# Altium schematic sheet Robot-Control V4.0.SchDoc: ROV-Control
size A4; Date: 2019.6.25; ApprovedBy: 10; CompanyName: 9; Engineer: 淹死的鱼; Organization: 5; Address1: ROV/AUV; Address2: V1.0; Address3: 淹死的鱼; Address4: 12; DocumentNumber: P1; Revision: 3; SheetNumber: 2; SheetTotal: 1; Time: 2019.4.6; DocumentFullPathAndName: 8; DocumentName: 7; ModifiedDate: 6; ImagePath: C:\Users\zengwangfa\Pictures\Saved Pictures\电协logo重绘（10000像素版）.png; ProjectName: 4; Application_BuildNumber: 11
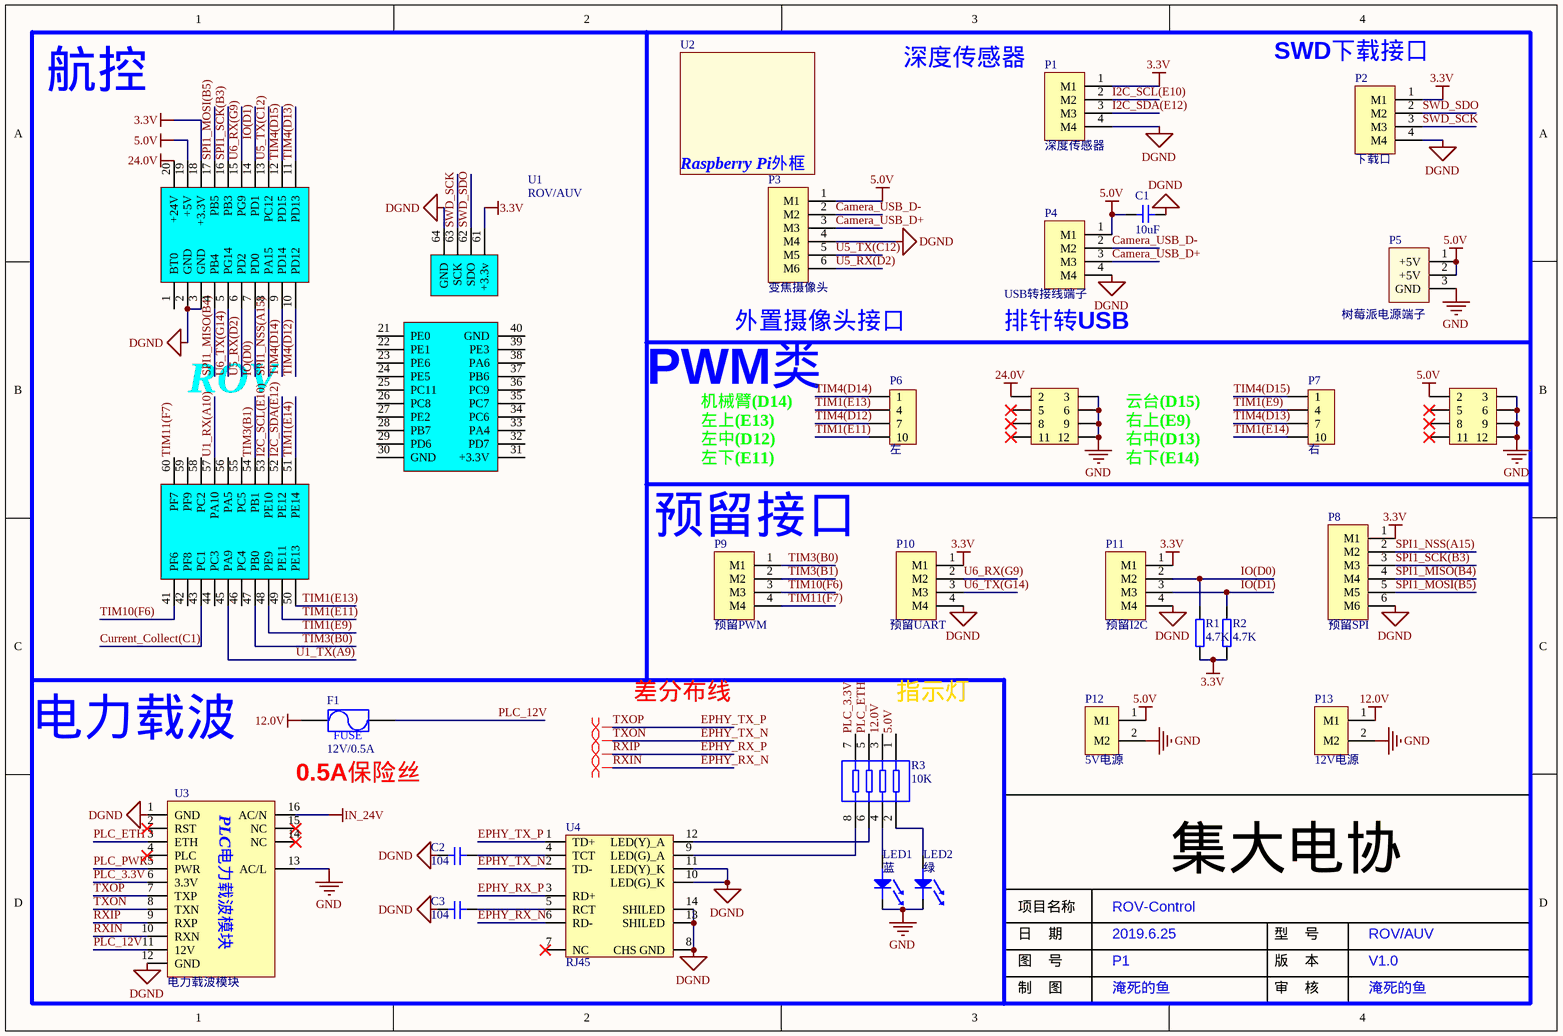
[diagram p0: Robot-Control V4.0.SchDoc]

## Parts
?  (no value)  [JMU_LOGO(1.35cm)]
C1  10uF  [0805C]
C2  104  [0805C]
C3  104  [0805C]
F1  12V/0.5A  [FUSE-1206]
LED1  蓝  [0805LED(RED)]
LED2  绿  [0805LED(RED)]
P1  深度传感器  [MX1.25WS-4P]
P2  下载口  [MX1.25WS-4P]
P3  变焦摄像头  [MX1.25WS-6P]
P4  USB转接线端子  [MX1.25WS-4P]
P5  树莓派电源端子  [XH3/2.54mm/180]
P6  左  [Header 4X3]
P7  右  [Header 4X3]
P8  预留SPI  [MX1.25WS-6P]
P9  预留PWM  [MX1.25WS-4P]
P10  预留UART  [MX1.25WS-4P]
P11  预留I2C  [MX1.25WS-4P]
P12  5V电源  [KF128-2P]
P13  12V电源  [KF128-2P]
R1  4.7K  [0805R]
R2  4.7K  [0805R]
R3  10K  [排阻(4位贴片)]
U1  ROV/AUV  [ROV_CONTROLLER]
U2  (no value)  [Raspberry Pi 外框]
U3  电力载波模块  [电力载波模块6410]
U4  RJ45  [RJ45]

## Nets
3.3V: P1.1(M1) P2.1(M1) P8.1(M1) P10.1(M1) P11.1(M1) R1.1 R2.1 U1.18(+3.3V) U1.61(+3.3v)
5.0V: C1.2 P3.1(M1) P4.1(M1) P5.1(+5V) P5.2(+5V) P7.2 P12.1(M1) R3.1 U1.19(+5V)
12.0V: F1.1 P13.1(M1) R3.3
24.0V: P6.2 U1.20(+24V)
DGND: C1.1 C2.1 C3.1 P1.4(M4) P2.4(M4) P3.4(M4) P4.4(M4) P8.6(M6) P10.4(M4) P11.4(M4) U1.2(GND) U1.3(GND) U1.64(GND) U3.1(GND) U3.12(GND) U4.8(CHS_GND) U4.10(LED(G)_K) U4.11(LED(Y)_K) U4.13(SHILED) U4.14(SHILED)
GND: LED1.2 LED2.2 P5.3(GND) P6.3 P6.6 P6.9 P6.12 P7.3 P7.6 P7.9 P7.12 P12.2(M2) P13.2(M2) U3.13(AC/L)
IN_24V: U3.16(AC/N)
Camera_USB_D+: P3.3(M3) P4.3(M3)
Camera_USB_D-: P3.2(M2) P4.2(M2)
Current_Collect(C1): U1.43(PC1)
EPHY_RX_N: U3.10(RXN) U4.6(RD-)  [also labelled RXIN]
EPHY_RX_P: U3.9(RXP) U4.3(RD+)  [also labelled RXIP]
EPHY_TX_N: U3.8(TXN) U4.2(TD-)  [also labelled TXON]
EPHY_TX_P: U3.7(TXP) U4.1(TD+)  [also labelled TXOP]
I2C_SCL(E10): P1.2(M2) U1.53(PE10)
I2C_SDA(E12): P1.3(M3) U1.52(PE12)
IO(D0): P11.2(M2) R1.2 U1.7(PD0)
IO(D1): P11.3(M3) R2.2 U1.14(PD1)
PLC_3.3V: R3.7 U3.6(3.3V)
PLC_12V: F1.2 U3.11(12V)
PLC_ETH: R3.5 U3.3(ETH)
PLC_PWR: U3.5(PWR)
SPI1_MISO(B4): P8.4(M4) U1.4(PB4)
SPI1_MOSI(B5): P8.5(M5) U1.17(PB5)
SPI1_NSS(A15): P8.2(M2) U1.8(PA15)
SPI1_SCK(B3): P8.3(M3) U1.16(PB3)
SWD_SCK: P2.3(M3) U1.63(SCK)
SWD_SDO: P2.2(M2) U1.62(SDO)
TIM1(E9): P7.4 U1.48(PE9)
TIM1(E11): P6.10 U1.49(PE11)
TIM1(E13): P6.4 U1.50(PE13)
TIM1(E14): P7.10 U1.51(PE14)
TIM3(B0): P9.1(M1) U1.47(PB0)
TIM3(B1): P9.2(M2) U1.54(PB1)
TIM4(D12): P6.7 U1.10(PD12)
TIM4(D13): P7.7 U1.11(PD13)
TIM4(D14): P6.1 U1.9(PD14)
TIM4(D15): P7.1 U1.12(PD15)
TIM10(F6): P9.3(M3) U1.41(PF6)
TIM11(F7): P9.4(M4) U1.60(PF7)
U1_RX(A10): U1.57(PA10)
U1_TX(A9): U1.45(PA9)
U5_RX(D2): P3.6(M6) U1.6(PD2)
U5_TX(C12): P3.5(M5) U1.13(PC12)
U6_RX(G9): P10.2(M2) U1.15(PG9)
U6_TX(G14): P10.3(M3) U1.5(PG14)
NetC2_2: C2.2 U4.4(TCT)
NetC3_2: C3.2 U4.5(RCT)
NetLED1_1: LED1.1 R3.4
NetLED2_1: LED2.1 R3.2
NetR3_6: R3.6 U4.12(LED(Y)_A)
NetR3_8: R3.8 U4.9(LED(G)_A)

Not connected (* = marked no-connect by the designer): P6 5* 8* 11*; P7 5* 8* 11*; U1 1(BT0) 21(PE0) 22(PE1) 23(PE6) 24(PE5) 25(PC11) 26(PC8) 27(PE2) 28(PB7) 29(PD6) 30(GND) 31(+3.3V) 32(PD7) 33(PA4) 34(PC6) 35(PC7) 36(PC9) 37(PB6) 38(PA6) 39(PE3) 40(GND) 42(PF8) 44(PC3) 46(PC4) 55(PC5) 56(PA5) 58(PC2) 59(PF9); U3 2(RST)* 4(PLC)* 14(NC)* 15(NC)*; U4 7(NC)*

## Layout directives
differential pair: EPHY_RX_N, EPHY_RX_P, EPHY_TX_N, EPHY_TX_P

## Notes on the sheet
- 航控
- 深度传感器
- (near P2) SWD下载接口
- (near P3) 外置摄像头接口
- (near P4) 排针转USB
- PWM类
- 机械臂(D14)
  左上(E13)
  左中(D12)
  左下(E11)
- 云台(D15)
  右上(E9)
  右中(D13)
  右下(E14)
- (near P9) 预留接口
- 差分布线
- 指示灯
- 电力载波
- 0.5A保险丝
- 集大电协
- 项目名称
- 日    期
- 图    号
- 版    本
- 型    号
- 制    图
- 审    核
- (in symbol Fuse) FUSE
- (in symbol Raspberry Pi 外框) Raspberry Pi外框
- (in symbol ROV_Controler) ROV
- (in symbol 电力载波模块6410) PLC电力载波模块

## Library data of the parts
? = JMU_LOGO: LOGO
C1-C3 = Cap1: 无极贴片电容
F1 = Fuse: 保险丝
LED1 LED2 = LED: 发光二极管
P1 P2 P4 P9-P11 = 接线端子-4PIN: 4PIN
P3 P8 = 接线端子-6PIN: 6PIN
P5 = 接线端子-3PIN: 3PIN
P6 P7 = Header 4X3
P12 P13 = 接线端子-2PIN: 2PIN
R1 R2 = Res: 电阻
R3 = Res-4: 排阻
U1 = ROV_Controler
U2 = Raspberry Pi 外框
U3 = 电力载波模块6410